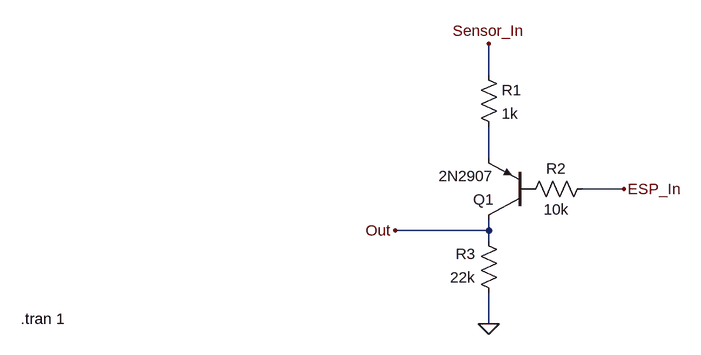
[diagram p0: schematic PNP_Switch.asc]
PNP_Switch.asc, the LTspice schematic file:
Version 4
SHEET 1 884 680
WIRE 576 0 576 -48
WIRE 576 128 576 80
WIRE 784 176 720 176
WIRE 576 240 576 224
WIRE 576 240 432 240
WIRE 576 256 576 240
WIRE 576 384 576 336
FLAG 576 384 0
FLAG 432 240 Out
FLAG 784 176 ESP_In
FLAG 576 -48 Sensor_In
SYMBOL pnp 640 224 R180
SYMATTR InstName Q1
SYMATTR Value 2N2907
SYMBOL res 560 -16 R0
SYMATTR InstName R1
SYMATTR Value 1k
SYMBOL res 736 160 R90
WINDOW 0 0 56 VBottom 2
WINDOW 3 32 56 VTop 2
SYMATTR InstName R2
SYMATTR Value 10k
SYMBOL res 592 352 R180
WINDOW 0 36 76 Left 2
WINDOW 3 36 40 Left 2
SYMATTR InstName R3
SYMATTR Value 22k
TEXT -144 376 Left 2 !.tran 1

The netlist it stands for:
* PNP_Switch.asc
Q1 Out P001 N001 0 2N2907
R1 Sensor_In N001 1k
R2 ESP_In P001 10k
R3 0 Out 22k
.model NPN NPN
.model PNP PNP
.lib standard.bjt
.tran 1
.backanno
.end